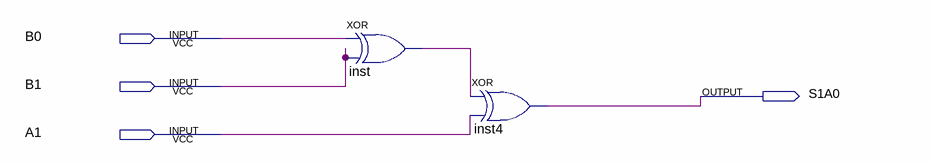
[diagram p0: schematic sheet]
// Quartus schematic S1A0.bdf as structural Verilog: 2 symbols, 4 pins
module S1A0 (
  input  B0,
  input  B1,
  input  A1,
  output S1A0
);

  wire inst_out;

  xor inst (inst_out, B0, B1);
  xor inst4 (S1A0, inst_out, A1);
endmodule
